# EAGLE design F50_cryocooler_controller (EAGLE 8.3.0)

## Sheet 1 of 2: P1 Module
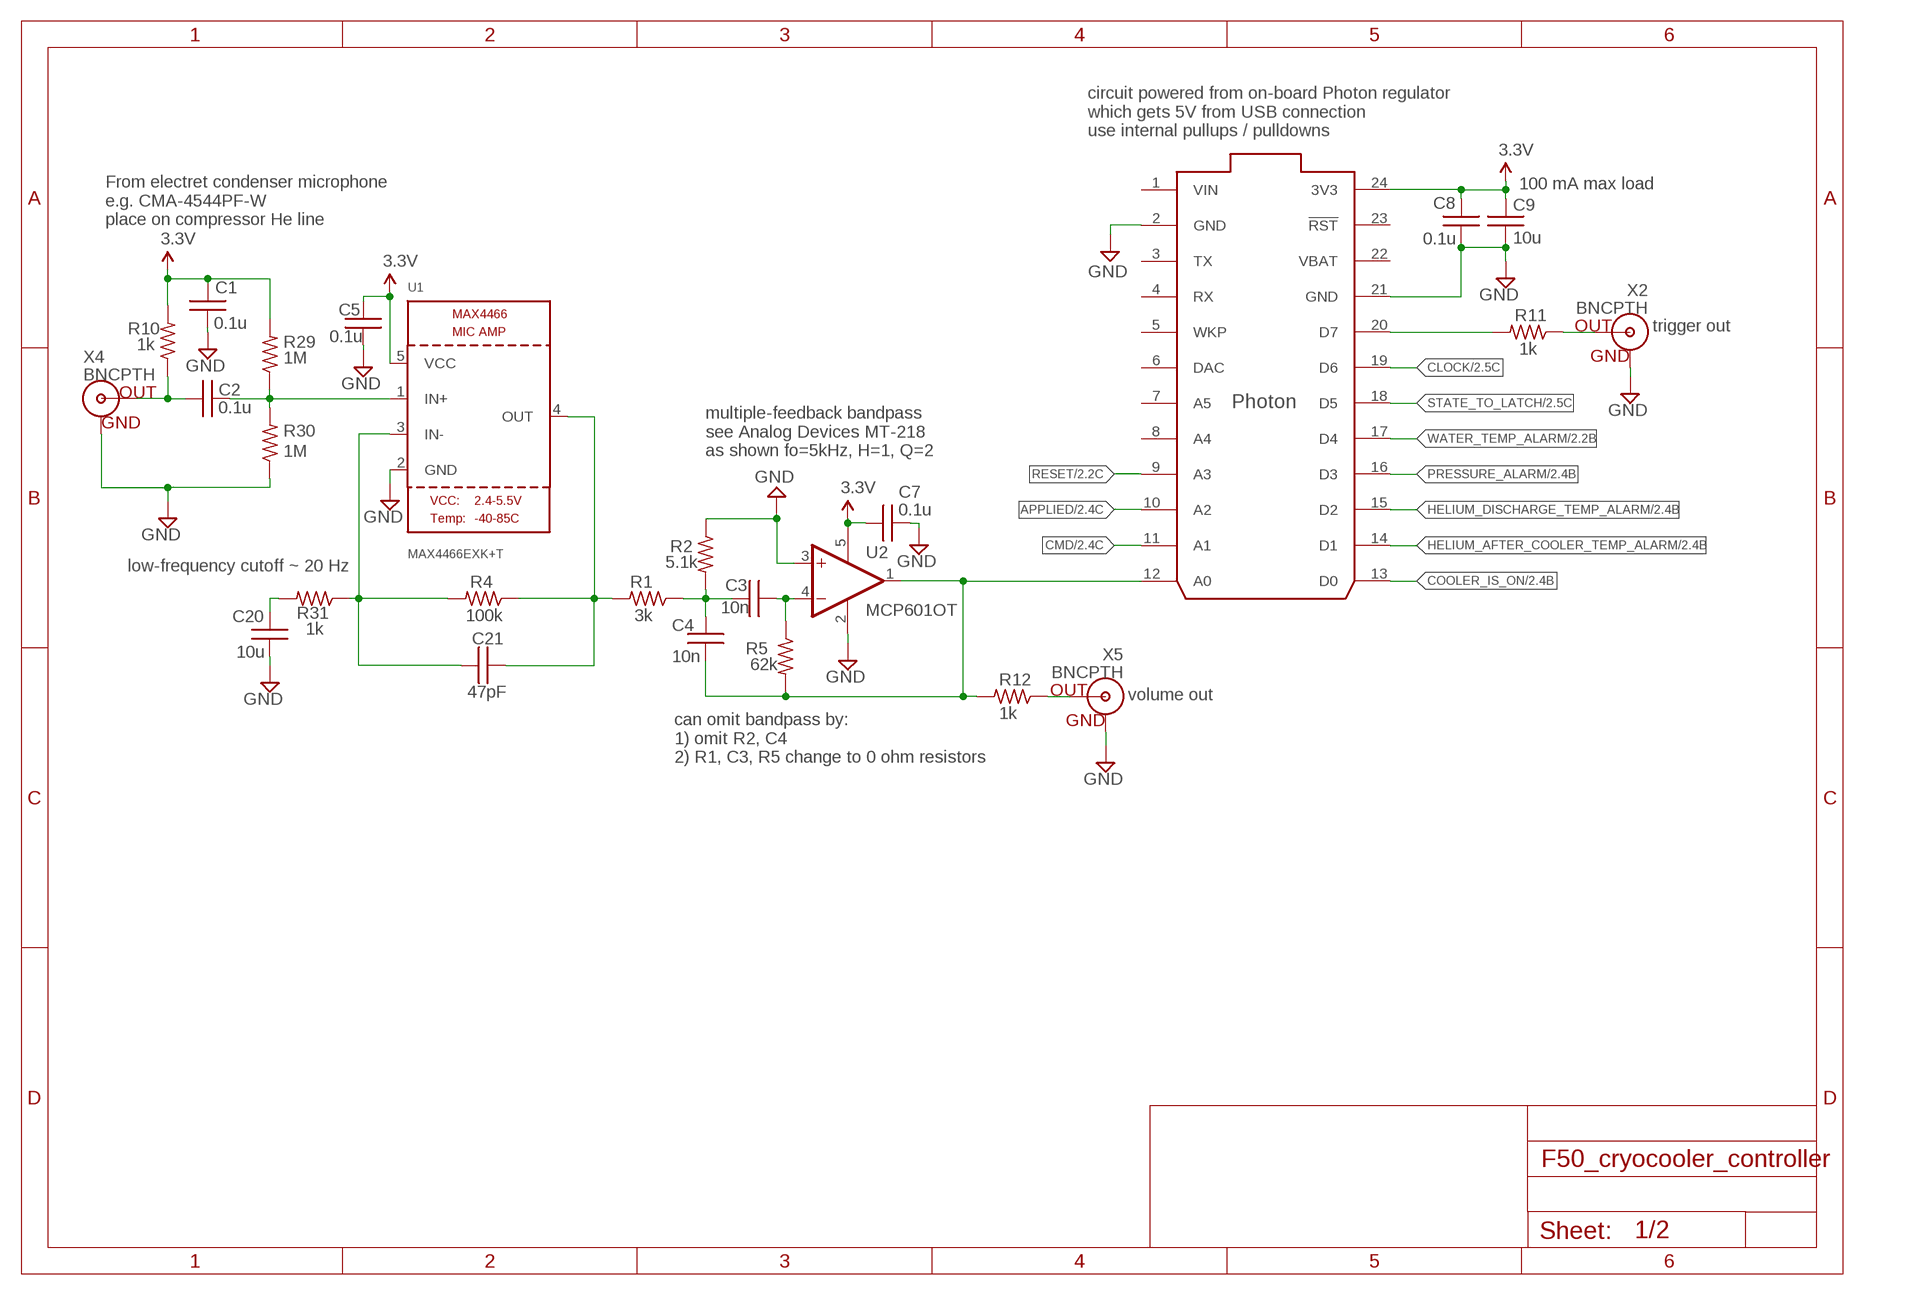
[diagram p0: schematic, sheet 1]

### Parts
C1  0.1u  C0603  [0603]
C2  0.1u  C0603  [0603]
C3  10n  C0603  [0603]
C4  10n  C0603  [0603]
C5  0.1u  C0603  [0603]
C7  0.1u  C0603  [0603]
C8  0.1u  C0603  [0603]
C9  10u  C0805  [0805]
C20  10u  C0603  [0603]
C21  47pF  C0603  [0603]
R1  3k  R0603  [0603]
R2  5.1k  R0603  [0603]
R4  100k  R0603  [0603]
R5  62k  R0603  [0603]
R10  1k  R0603  [0603]
R11  1k  R0603  [0603]
R12  1k  R0603  [0603]
R29  1M  R0603  [0603]
R30  1M  R0603  [0603]
R31  1k  R0603  [0603]
U1  MAX4466EXK+T  MAX4466""  [SC70-5]
U2  MCP601OT  [SOT23-5]
U3  PHOTON_WITH_HEADERS  [PHOTON]
X2  BNCPTH  [BNC]
X4  BNCPTH  [BNC]
X5  BNCPTH  [BNC]

### Nets
3.3V: C1.1 C5.1 C7.1 C8.1 C9.2 R10.2 R29.2 U1.5(VCC) U2.5(V+) U3.24(3V3)
APPLIED: U3.10(A2) ; also sheet 2
AUDIO_IN: C21.2 R1.2 R4.1 U1.4(OUT)
CLOCK: U3.19(D6) ; also sheet 2
CMD: U3.11(A1) ; also sheet 2
COOLER_IS_ON: U3.13(D0) ; also sheet 2
GND: C1.2 C5.2 C7.2 C8.2 C9.1 C20.2 R2.1 R30.1 U1.2(GND) U2.2(V-) U2.3(+IN) U3.2(GND) U3.21(GND) X2.GND X4.GND X5.GND ; also sheet 2
HELIUM_AFTER_COOLER_TEMP_ALARM: U3.14(D1) ; also sheet 2
HELIUM_DISCHARGE_TEMP_ALARM: U3.15(D2) ; also sheet 2
N$1: C2.1 R10.1 X4.S(OUT)
N$2: C2.2 R29.1 R30.2 U1.1(IN+)
N$3: C21.1 R4.2 R31.1 U1.3(IN-)
N$4: C20.1 R31.2
N$5: C3.1 C4.2 R1.1 R2.2
N$8: C3.2 R5.1 U2.4(-IN)
N$10: R11.2 U3.20(D7)
N$15: C4.1 R5.2 R12.2 U2.1(OUT) U3.12(A0)
PRESSURE_ALARM: U3.16(D3) ; also sheet 2
RESET: U3.9(A3) ; also sheet 2
STATE_TO_LATCH: U3.18(D5) ; also sheet 2
SYNC_OUT: R11.1 X2.S(OUT)
TRIGGER_OUT: R12.1 X5.S(OUT)
WATER_TEMP_ALARM: U3.17(D4) ; also sheet 2
Unconnected: U3.3(TX) U3.4(RX) U3.5(WKP) U3.6(DAC) U3.7(A5) U3.8(A4) U3.23(!RST)

### Notes on the sheet
- circuit powered from on-board Photon regulator
  which gets 5V from USB connection
  use internal pullups / pulldowns
- 100 mA max load
- From electret condenser microphone
  e.g. CMA-4544PF-W
  place on compressor He line
- trigger out
- multiple-feedback bandpass
  see Analog Devices MT-218
  as shown fo=5kHz, H=1, Q=2
- low-frequency cutoff ~ 20 Hz
- volume out
- can omit bandpass by:
  1) omit R2, C4
  2) R1, C3, R5 change to 0 ohm resistors

## Sheet 2 of 2: cryocooler connections
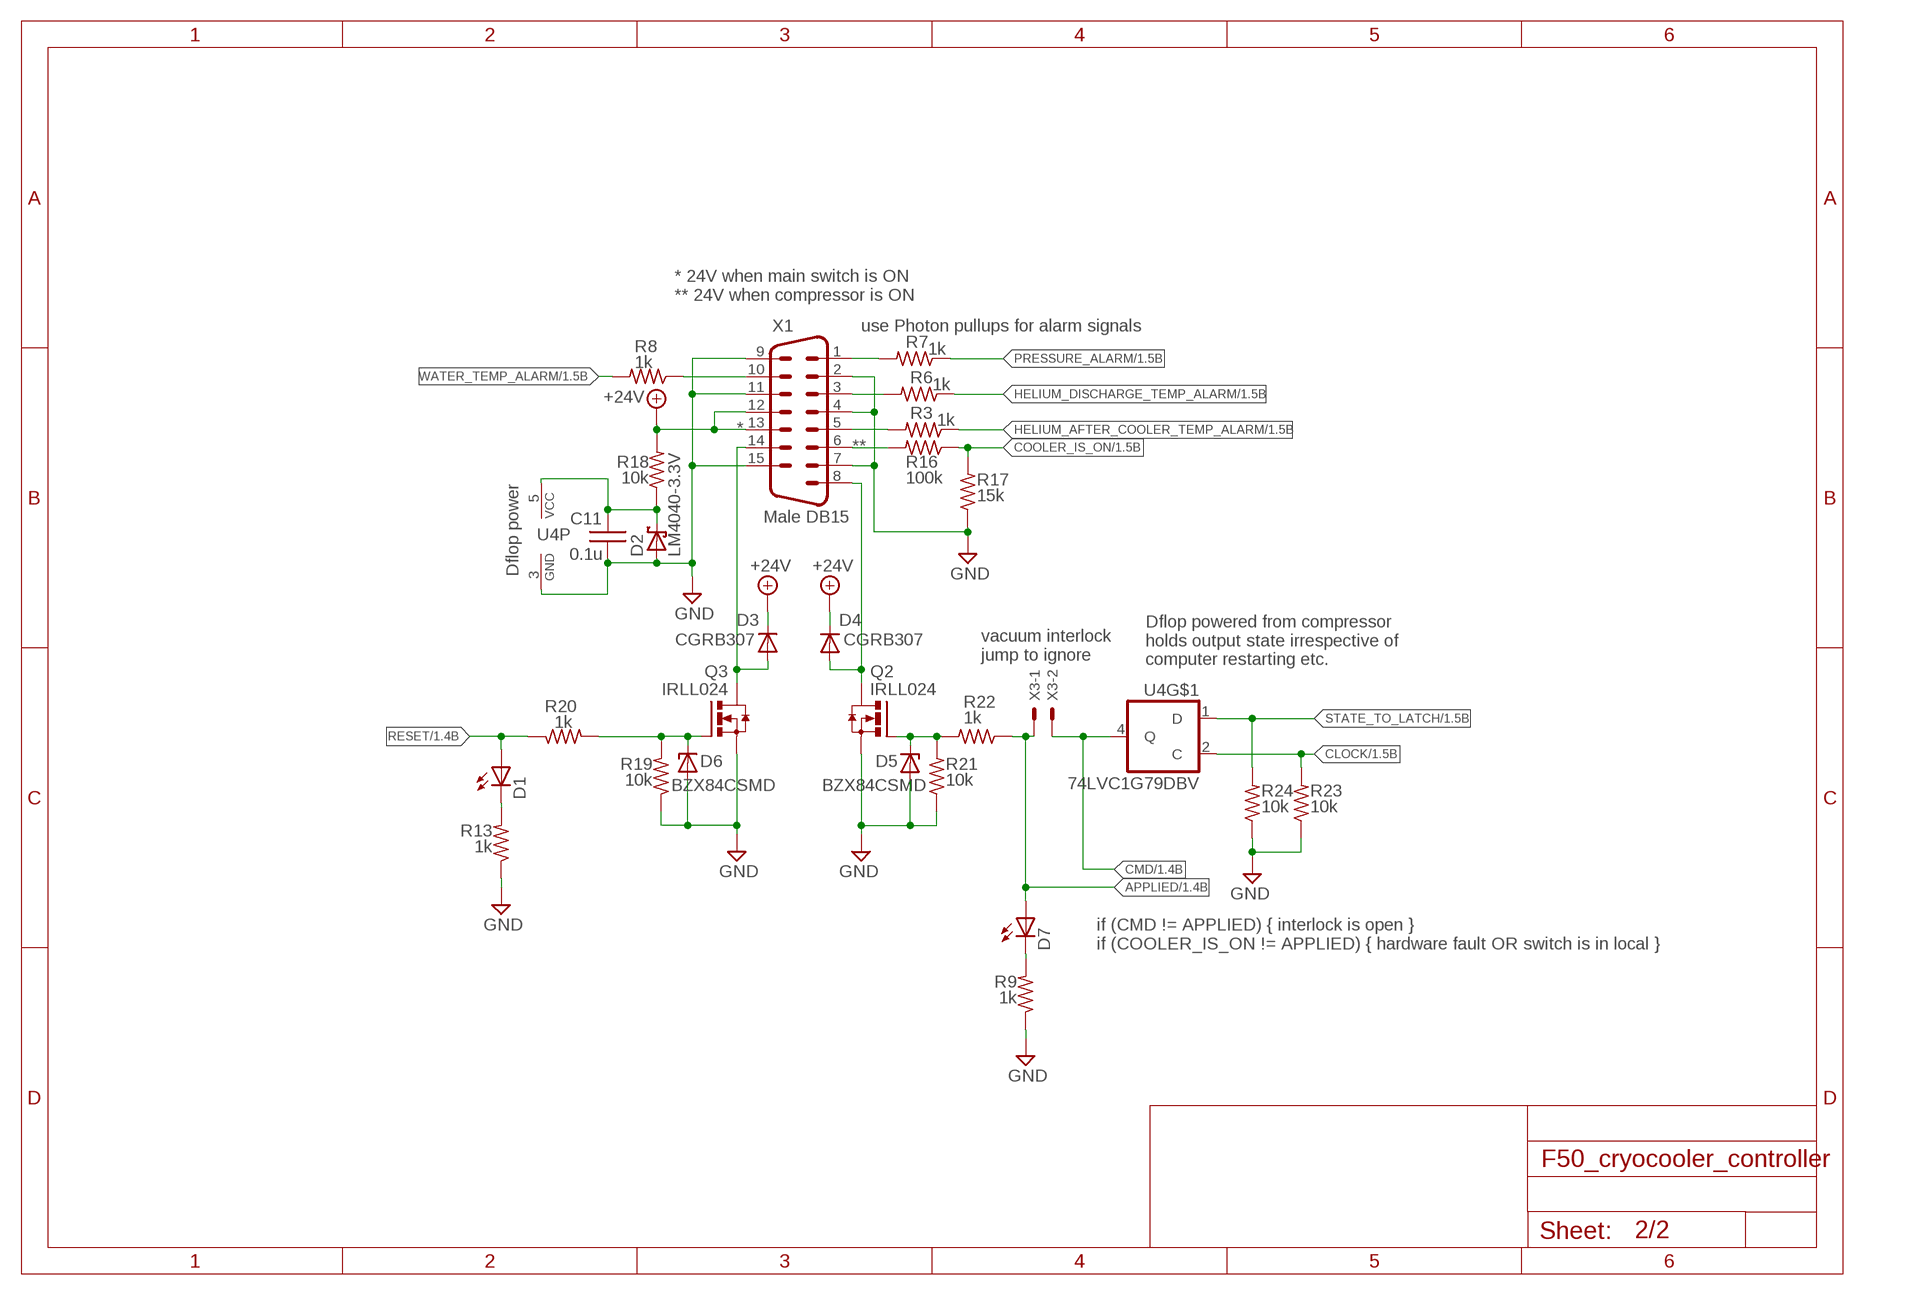
[diagram p1: schematic, sheet 2]

### Parts
C11  0.1u  C0603  [0603]
D1  LED0603  [LED0603]
D2  LM4040-3.3V  LM4040  [SOT23]
D3  CGRB307  DIODE-DO214AA  [DO214AA]
D4  CGRB307  DIODE-DO214AA  [DO214AA]
D5  BZX84CSMD  [TO236]
D6  BZX84CSMD  [TO236]
D7  LED0603  [LED0603]
Q2  IRLL024  N-HEXFET_SOT323-IRLL014N  [SOT223]
Q3  IRLL024  N-HEXFET_SOT323-IRLL014N  [SOT223]
R3  1k  R0603  [0603]
R6  1k  R0603  [0603]
R7  1k  R0603  [0603]
R8  1k  R0603  [0603]
R9  1k  R0603  [0603]
R13  1k  R0603  [0603]
R16  100k  R0603  [0603]
R17  15k  R0603  [0603]
R18  10k  R0603  [0603]
R19  10k  R0603  [0603]
R20  1k  R0603  [0603]
R21  10k  R0603  [0603]
R22  1k  R0603  [0603]
R23  10k  R0603  [0603]
R24  10k  R0603  [0603]
U4  74LVC1G79DBV  [SOT23-5]
X1  Male DB15  M15HP  [M15HP]
X3  22-23-2021  [22-23-2021]

### Nets
+24V: D3.C D4.C R18.2 X1.12 X1.13
APPLIED: D7.A R22.1 X3.1 ; also sheet 1
CLOCK: R23.2 U4.2(C) ; also sheet 1
CMD: U4.4(Q) X3.2 ; also sheet 1
COOLER_IS_ON: R16.1 R17.2 ; also sheet 1
GND: C11.2 D2.2(A) D5.A D6.A Q2.3(S) Q3.3(S) R9.1 R13.1 R17.1 R19.1 R21.1 R23.1 R24.1 U4.3(GND) X1.2 X1.4 X1.7 X1.9 X1.11 X1.15 ; also sheet 1
HELIUM_AFTER_COOLER_TEMP_ALARM: R3.1 ; also sheet 1
HELIUM_DISCHARGE_TEMP_ALARM: R6.1 ; also sheet 1
N$6: R8.1 X1.10
N$7: R16.2 X1.6
N$9: R7.2 X1.1
N$11: D4.A Q2.4(D) X1.8
N$12: R6.2 X1.3
N$13: D5.C Q2.1(G) R21.2 R22.2
N$14: C11.1 D2.1(C) R18.1 U4.5(VCC)
N$16: R3.2 X1.5
N$17: D1.C R13.2
N$18: D7.C R9.2
N$19: D3.A Q3.4(D) X1.14
N$20: D6.C Q3.1(G) R19.2 R20.2
PRESSURE_ALARM: R7.1 ; also sheet 1
RESET: D1.A R20.1 ; also sheet 1
STATE_TO_LATCH: R24.2 U4.1(D) ; also sheet 1
WATER_TEMP_ALARM: R8.2 ; also sheet 1

### Notes on the sheet
- * 24V when main switch is ON
  ** 24V when compressor is ON
- use Photon pullups for alarm signals
- *
- **
- Dflop power
- vacuum interlock
  jump to ignore
- Dflop powered from compressor
  holds output state irrespective of
  computer restarting etc.
- if (CMD \!= APPLIED) { interlock is open }
  if (COOLER_IS_ON \!= APPLIED) { hardware fault OR switch is in local }

## Power pins joined to a net without a drawn wire
VBAT: U3.22(VBAT)
VIN: U3.1(VIN)

## Library data of the parts
C1-C5 C7-C9 C11 C20 C21 = acrooptics:C: Capacitor
D1 D7 = acrooptics:LED: LED OSRAM: - CHIPLED LG R971, LG N971, LY N971, LG Q971, LY Q971, LO R971, LY R971 LH N974, LH R974 LS Q976, LO Q976, LY Q976 LO Q996 - Hyper CHIPLED LW Q18S LB Q993, LB Q99A, LB R99A - SideLED LS A670, LO A670, LY A670, LG A670, LP A670 LB A673, LV A673, LT A673, LW A673 LH A674 LY A675 LS A676, LA A676, LO A676, LY A676, LW A676 LS A679, LY A679, LG A679 - Hyper Micro SIDELED® LS Y876, LA Y876, LO Y876, LY Y876 LT Y87S - SmartLED LW L88C, LW L88S LB L89C, LB L89S, LG L890 LS L89K, LO L89K, LY L89K LS L896, LA L896, LO L896, LY L896 - TOPLED LS T670, LO T670, LY T670, LG T670, LP T670 LSG T670, LSP T670, LSY T670, LOP T670, LYG T670 LG T671, LOG T671, LSG T671 LB T673, LV T673, LT T673, LW T673 LH T674 LS T676, LA T676, LO T676, LY T676, LB T676, LH T676, LSB T676, LW T676 LB T67C, LV T67C, LT T67C, LS T67K, LO T67K, LY T67K, LW E67C LS E67B, LA E67B, LO E67B, LY E67B, LB E67C, LV E67C, LT E67C LW T67C LS T679, LY T679, LG T679 LS T770, LO T770, LY T770, LG T770, LP T770 LB T773, LV T773, LT T773, LW T773 LH T774 LS E675, LA E675, LY E675, LS T675 LS T776, LA T776, LO T776, LY T776, LB T776 LHGB T686 LT T68C, LB T68C - Hyper Mini TOPLED® LB M676 - Mini TOPLED Santana® LG M470 LS M47K, LO M47K, LY M47K Source: http://www.osram.convergy.de LUXEON: - LUMILED® LXK2-PW12-R00, LXK2-PW12-S00, LXK2-PW14-U00, LXK2-PW14-V00 LXK2-PM12-R00, LXK2-PM12-S00, LXK2-PM14-U00 LXK2-PE12-Q00, LXK2-PE12-R00, LXK2-PE12-S00, LXK2-PE14-T00, LXK2-PE14-U00 LXK2-PB12-K00, LXK2-PB12-L00, LXK2-PB12-M00, LXK2-PB14-N00, LXK2-PB14-P00, LXK2-PB14-Q00 LXK2-PR12-L00, LXK2-PR12-M00, LXK2-PR14-Q00, LXK2-PR14-R00 LXK2-PD12-Q00, LXK2-PD12-R00, LXK2-PD12-S00 LXK2-PH12-R00, LXK2-PH12-S00 LXK2-PL12-P00, LXK2-PL12-Q00, LXK2-PL12-R00 Source: www.luxeon.com KINGBRIGHT: KA-3528ASYC Source: www.kingbright.com
D2 = Fitch:LM4040: LM4040 Reference Zener Diode
D3 D4 = diode:DIODE-: DIODE
D5 D6 = diode:BZX84CSMD: Z DIODE
Q2 Q3 = transistor-power:N-HEXFET_?-*: HEXFET® Power MOSFET
R1-R13 R16-R24 R29-R31 = acrooptics:R: 0603 resistor
U1 = microbuilder:MAX4466: MAX4466 - Microphone Pre-Amp
U2 = linear:MCP601: Single Op Amp 2.7V to 6.0V Single Supply CMOS Source: http://ww1.microchip.com/downloads/en/DeviceDoc/21314g.pdf
U3 = Spark:PHOTON
U4 = 74xx-little-de:74*1G79: Single Positive-Edge-Triggered D-Type Flip-Flop Source: Data sheet <http://www.ti.com/lit/ds/symlink/sn74lvc1g79.pdf>
X1 = con-subd:M15: SUB-D; OC_FARNELL: unknown; OC_NEWARK: unknown
X2 X4 X5 = SparkFun:BNC: BNC Connector, Mouser Part# 5227161
X3 = con-molex:22-23-2021: .100" (2.54mm) Center Header - 2 Pin; MF: MOLEX; MPN: 22-23-2021; OC_FARNELL: 1462926; OC_NEWARK: 25C3832

## Net classes
1 standard: width 0.61 mm, clearance 0.254 mm

## Board
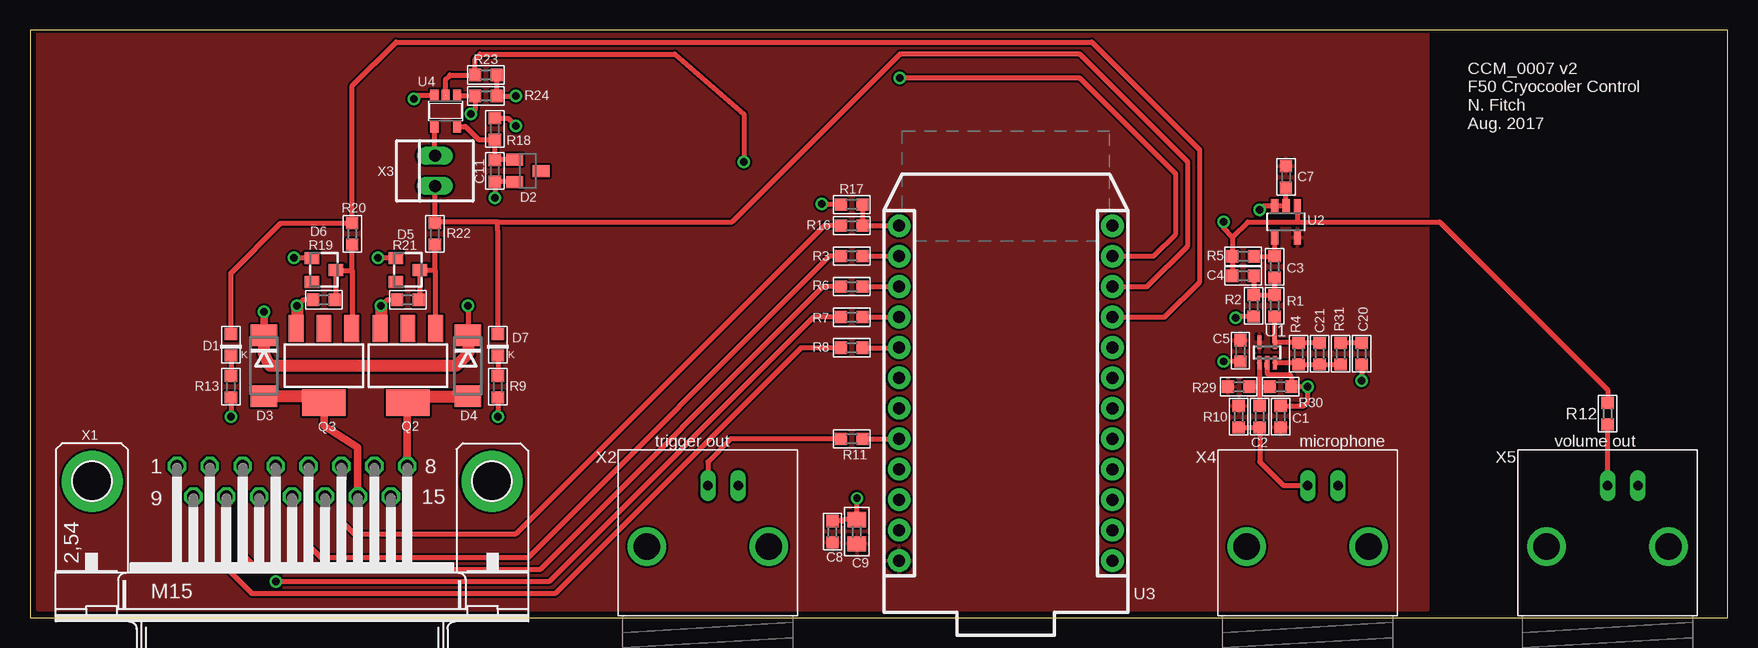
[diagram p2: board, top side]
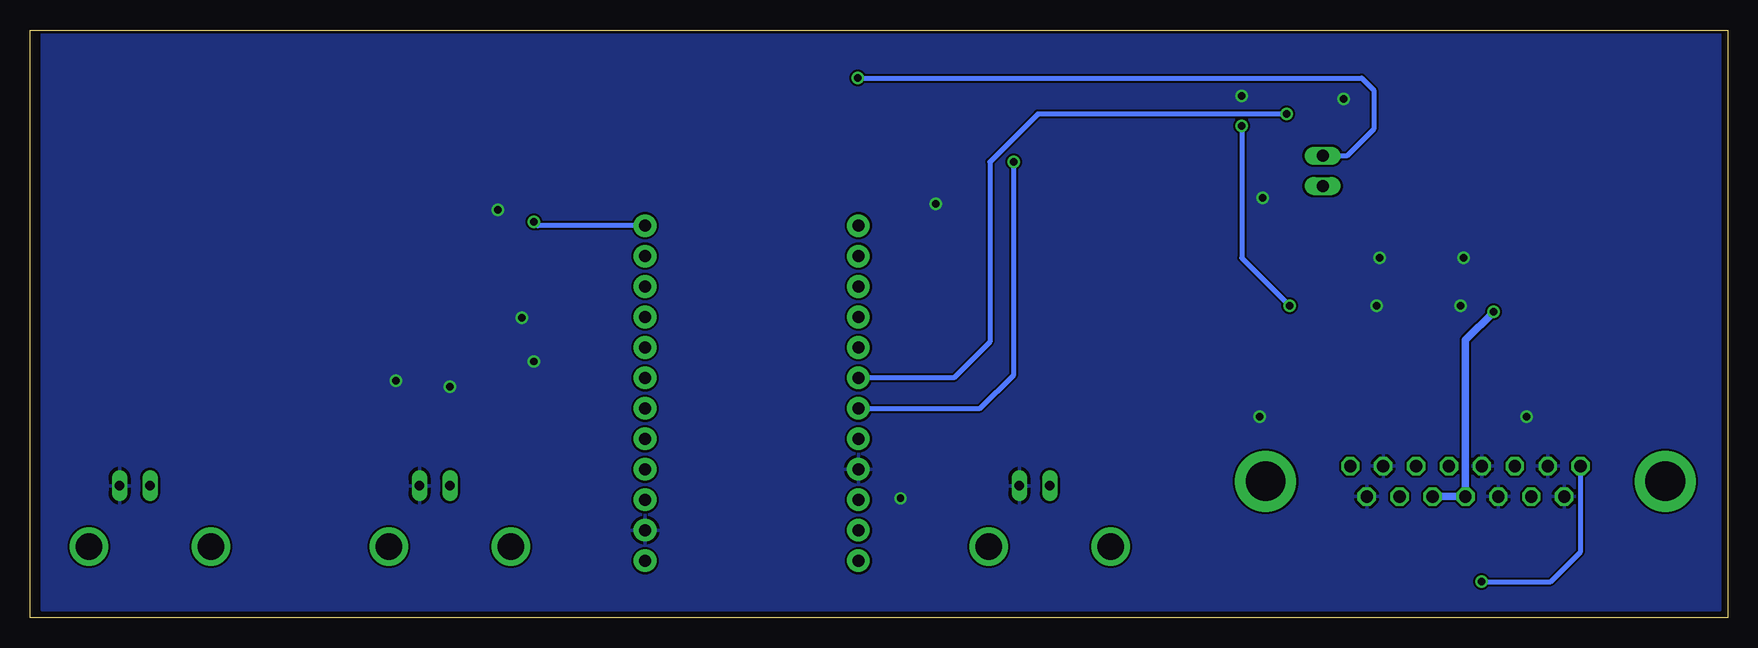
[diagram p3: board, bottom side, seen from below]

Size 141.5 x 49 mm. Coordinates in mm from the lower left corner, seen from the top.
Outline: 0,0 141.5,0 141.5,49 0,49 0,0
Copper layers (1*16): Top 0.035mm / dielectric 1.5mm / Bottom 0.035mm
Design rules "default *": minimum track width 10mil, minimum drill 10mil, track to track 7mil, track to pad 7mil, pad to pad 7mil, via to via 7mil, smd to smd 7mil, copper to edge 10mil, drill to drill 8mil, minimum pad ring 10mil, minimum via ring 8mil, stop-mask expansion 4mil, vias tented up to drill 0mil, thermal gap 10mil

### Footprints (pad centres in the part's own frame; a part is rotated, then mirrored left to right if it is on the bottom)
0603 = smd 1.016 x 1.016: 1 -0.889,0; 2 0.889,0
0805 = smd 1.27 x 1.524: 1 -1.016,0; 2 1.016,0
LED0603 = smd 1.016 x 1.016: A 0,-0.889; C 0,0.889
SOT23 = smd 1 x 1.4: 1 -0.95,-1.1; 2 0.95,-1.1; 3 0,1.1
DO214AA = smd 1.8 x 2.2: A 2.55,0; C -2.55,0
TO236 = smd 1 x 1.2: A -1,-1; C 0,1; NC 1,-1
SOT223 = smd 1.219 x 2.235: 1 -2.311,-3.099; 2 0,-3.099; 3 2.311,-3.099 | smd 3.6 x 2.2: 4 0,3.099
SC70-5 = smd 0.35 x 1.15: 1 -0.65,-0.85; 2 0,-0.85; 3 0.65,-0.85; 4 0.65,0.85; 5 -0.65,0.85
SOT23-5 = smd 0.6 x 1.2: 1 -0.95,-1.306; 2 0,-1.306; 3 0.95,-1.306; 4 0.95,1.306; 5 -0.95,1.306
PHOTON = drill 1.016 pad 1.88: 1 1.27,32.258; 2 1.27,29.718; 3 1.27,27.178; 4 1.27,24.638; 5 1.27,22.098; 6 1.27,19.558; 7 1.27,17.018; 8 1.27,14.478; 9 1.27,11.938; 10 1.27,9.398; 11 1.27,6.858; 12 1.27,4.318; 13 19.05,4.318; 14 19.05,6.858; 15 19.05,9.398; 16 19.05,11.938; 17 19.05,14.478; 18 19.05,17.018; 19 19.05,19.558; 20 19.05,22.098; 21 19.05,24.638; 22 19.05,27.178; 23 19.05,29.718; 24 19.05,32.258
SOT23-5' = smd 0.69 x 0.99: 1 -0.95,-1.29; 2 0,-1.29; 3 0.95,-1.29; 4 0.95,1.3; 5 -0.95,1.3
M15HP = drill 1.016 octagon: 1 -9.601,1.27; 2 -6.858,1.27; 3 -4.115,1.27; 4 -1.372,1.27; 5 1.372,1.27; 6 4.115,1.27; 7 6.858,1.27; 8 9.601,1.27; 9 -8.23,-1.27; 10 -5.486,-1.27; 11 -2.743,-1.27; 12 0,-1.27; 13 2.743,-1.27; 14 5.486,-1.27; 15 8.23,-1.27 | drill 3.302 pad 5.08: G1 -16.662,0; G2 16.662,0
BNC = drill 2.2: 3 -5.08,5.08; 4 5.08,5.08 | drill 0.8 long: GND -2.54,0; S 0,0
22-23-2021 = drill 1 long: 1 -1.27,0; 2 1.27,0

### Placement (x,y rotation side)
C1  104.25,16.75 90 top
C2  102.5,16.75 90 top
C3  103.75,29.25 90 top
C4  101.12,28.5 0 top
C5  100.89,22.23 270 top
C7  104.7,36.75 270 top
C8  66.89,7.16 90 top
C9  68.93,7.16 270 top
C11  38.75,37.25 270 top
C20  111,22 270 top
C21  107.5,22 90 top
D1  16.75,22.75 180 top
D2  41.5,37.25 270 top
D3  19.5,21 270 top
D4  36.5,21 270 top
D5  31.5,29 270 top
D6  24.5,29 270 top
D7  39,22.75 180 top
Q2  31.5,21 180 top
Q3  24.5,21 180 top
R1  103.75,26 270 top
R2  102,26 90 top
R3  68.5,30.15 180 top
R4  105.75,22 270 top
R5  101.12,30.12 180 top
R6  68.5,27.6 180 top
R7  68.5,25.05 180 top
R8  68.5,22.5 0 top
R9  39,19.25 90 top
R10  100.75,16.75 90 top
R11  68.5,14.9 0 top
R12  131.5,17 90 top
R13  16.75,19.25 90 top
R16  68.5,32.68 180 top
R17  68.5,34.44 0 top
R18  38.75,40.75 90 top
R19  24.5,26.5 0 top
R20  26.86,32 270 top
R21  31.5,26.5 0 top
R22  33.75,32 270 top
R23  38,45.25 180 top
R24  38,43.5 180 top
R29  100.75,19.25 180 top
R30  104.25,19.25 180 top
R31  109.25,22 90 top
U1  103.12,22.11 0 top
U2  104.7,33 180 top
U3  91.5,37 180 top
U4  74LVC1G79DBV  [SOT23-5']  34.65,42.25 180 top
X1  21.84,11.36 0 top
X2  56.5,11 180 top
X3  33.75,37.25 90 top
X4  106.5,11 180 top
X5  131.5,11 180 top

### Tracks (layer width: path | path; a pad name or v marks a point on that pad's centre or on a via)
3.3V
  pour Top: 0.64,0.63 0.64,49 116.5,49 116.5,0.63
+24V  (via drill 0.6)
  Top 0.406: R18.2 39.86,41.64 v40.5,41 | v36.5,26 D4.C
  Top 0.61: 20,21 19.5,21.5 v19.5,25.5
  Top 1.016: D4.C 36.5,22 35.5,21 20,21 19.5,22 D3.C
  Bottom 0.406: v40.5,41 40.5,30 v36.5,26
  Bottom 0.61: X1.13 X1.12 21.84,23.16 v19.5,25.5
APPLIED
  Top 0.406: X3.1 R22.1 33.86,33 38.99,33 | U3.10 93.1,27.6 96.5,31 96.5,38 87.5,47 72.5,47 58.5,33 38.99,33 | D7.A 39,32.25 38.99,32.26 38.99,33
AUDIO_IN
  Top 0.406: C21.2 R4.1 105.89,22.96 U1.4 103.77,25.09 R1.2
CLOCK  (via drill 0.6)
  Top 0.406: U4.2 34.65,44.9 35,45.25 R23.2 37.11,46.61 37.5,47 53.75,47 59.5,42 v59.5,38
  Bottom 0.406: v59.5,38 59.5,20.25 62.31,17.44 U3.19
CMD  (via drill 0.6)
  Top 0.406: U4.4 33.7,38.57 X3.2 | U3.11 93.64,30.14 95.5,32 95.5,37 87.5,45 v72.5,45
  Bottom 0.406: v72.5,45 30.5,45 29.5,44 29.5,40.75 31.75,38.5 33.73,38.5 X3.2
COOLER_IS_ON
  Top 0.406: U3.13 72.43,32.68 R16.1 R17.2
GND  (via drill 0.6)
  Top 0.406: C8.2 67.73,8.05 67.86,8.17 C9.1 v68.93,9.95 | C5.2 v99.5,21.34 | C20.2 v111,19.75 | U1.2 103.12,20.38 103.25,20.25 105,20.25 105.14,20.11 R30.1 v106.5,19.25 106.5,18 106.14,17.64 C1.2 | R2.1 100.61,25.11 v100.5,25 | C7.2 U2.2 U2.3 102.81,34.31 v102.5,34 | U4.3 32.29,43.54 v32,43.25 | D6.A v22,30 | R19.1 22.75,26.5 v22.25,26 | R21.1 29.75,26.5 v29.25,26 | D5.A v29,30 | D2.2 40.34,36.36 C11.2 v38.75,35 | R23.1 R24.1 v40.5,43.5 | R17.1 66.06,34.44 v66,34.5 | R13.1 v16.75,16.75 | R9.1 v39,16.75
  Top 1.016: Q3.3 22.25,24.2 v22.25,26 | Q2.3 29.25,24.16 v29.25,26
  pour Bottom: 0.64,0.63 0.64,49 140.5,49 140.5,0.63
HELIUM_AFTER_COOLER_TEMP_ALARM
  Top 0.406: R3.1 U3.14
HELIUM_DISCHARGE_TEMP_ALARM
  Top 0.406: R6.1 U3.15
N$1
  Top 0.406: X4.S 104.5,11 102.5,13 102.5,15.82 | 102.5,15.82 C2.1 | R10.1 102.45,15.86 102.5,15.82
N$2
  Top 0.406: 102.55,19.25 R29.1 | 102.55,19.25 102.63,19.25 | 102.63,19.25 R30.2 | C2.2 102.5,19.12 102.63,19.25 | U1.1 102.47,19.32 102.55,19.25
N$3
  Top 0.406: U1.3 105.81,21.26 R4.2 C21.1 R31.1
N$4
  Top 0.406: C20.1 R31.2
N$5
  Top 0.406: C3.1 R1.1 R2.2 102.01,26.9 C4.2
N$6
  Top 0.406: R8.1 64.25,22.5 43.75,2 18.5,2 16.36,4.14 X1.10
N$7
  Top 0.406: X1.6 25.96,8.04 27,7 40.5,7 66.25,32.75 67.61,32.75 R16.2
N$8
  Top 0.406: R5.1 103.74,30.12 C3.2 U2.4
N$9  (via drill 0.6)
  Top 0.406: R7.2 65.3,25.05 43.25,3 v20.5,3
  Bottom 0.406: v20.5,3 14.75,3 12.25,5.5 X1.1
N$10
  Top 0.406: R11.2 U3.20
N$11
  Top 0.61: Q2.4 31.45,17.85 X1.8
  Top 1.016: Q2.4 32.05,18.45 D4.A
N$12
  Top 0.406: R6.2 66.1,27.6 42.5,4 19,4 17.75,5.25 17.75,12.61 X1.3
N$13
  Top 0.406: 33.75,24.16 Q2.1 33.75,24.1 33.75,29 | R21.2 32.5,26.61 D5.C 33.75,29 | 33.75,29 R22.2
N$14
  Top 0.406: U4.5 36.3,40.95 37.39,39.86 R18.1 C11.1 38.81,38.2 D2.1
N$15  (via drill 0.6)
  Top 0.406: 100.24,31.74 R5.2 C4.1 | 100.24,31.74 101.5,33 105.5,33 | U2.1 105.65,33.15 105.5,33 | 105.5,33 117.5,33 131.5,19 R12.2 | 100.24,31.74 99.5,32.47 v99.5,33
  Bottom 0.406: U3.12 99.18,32.68 v99.5,33
N$16
  Top 0.406: R3.2 66.65,30.15 41.5,5 24.25,5 23.22,6.03 X1.5
N$17
  Top 0.406: D1.C R13.2
N$18
  Top 0.406: D7.C R9.2
N$19
  Top 0.61: Q3.4 24.5,16 27.33,14.17 X1.14
  Top 1.016: Q3.4 23.94,18.45 D3.A
N$20
  Top 0.406: Q3.1 arc90 26.86,24.2 26.86,28.93 | 26.86,28.93 R20.2 | 26.86,28.93 25.57,28.93 arc-90 D6.C 25.5,26.61 arc-90 R19.2
PRESSURE_ALARM
  Top 0.406: R7.1 72.44,25.05 U3.16
RESET
  Top 0.406: U3.9 94.56,25.06 97.5,28 97.5,39 88.5,48 30.5,48 26.86,44.37 R20.1 20.89,32.89 16.75,28.75 D1.A
STATE_TO_LATCH  (via drill 0.6)
  Top 0.406: U4.1 37.07,43.54 R24.2 37.11,42.36 v36.75,42
  Bottom 0.406: v36.75,42 57.5,42 61.5,38 61.5,23 64.5,20 72.43,20 U3.18
SYNC_OUT
  Top 0.406: R11.1 58.4,14.9 56.5,13 X2.S
TRIGGER_OUT
  Top 0.406: X5.S R12.1
WATER_TEMP_ALARM
  Top 0.406: U3.17 72.43,22.5 R8.2

### Text on the board
tPlace: CCM_0007 v2 / F50 Cryocooler Control / N. Fitch / Aug. 2017 | trigger out | microphone | volume out